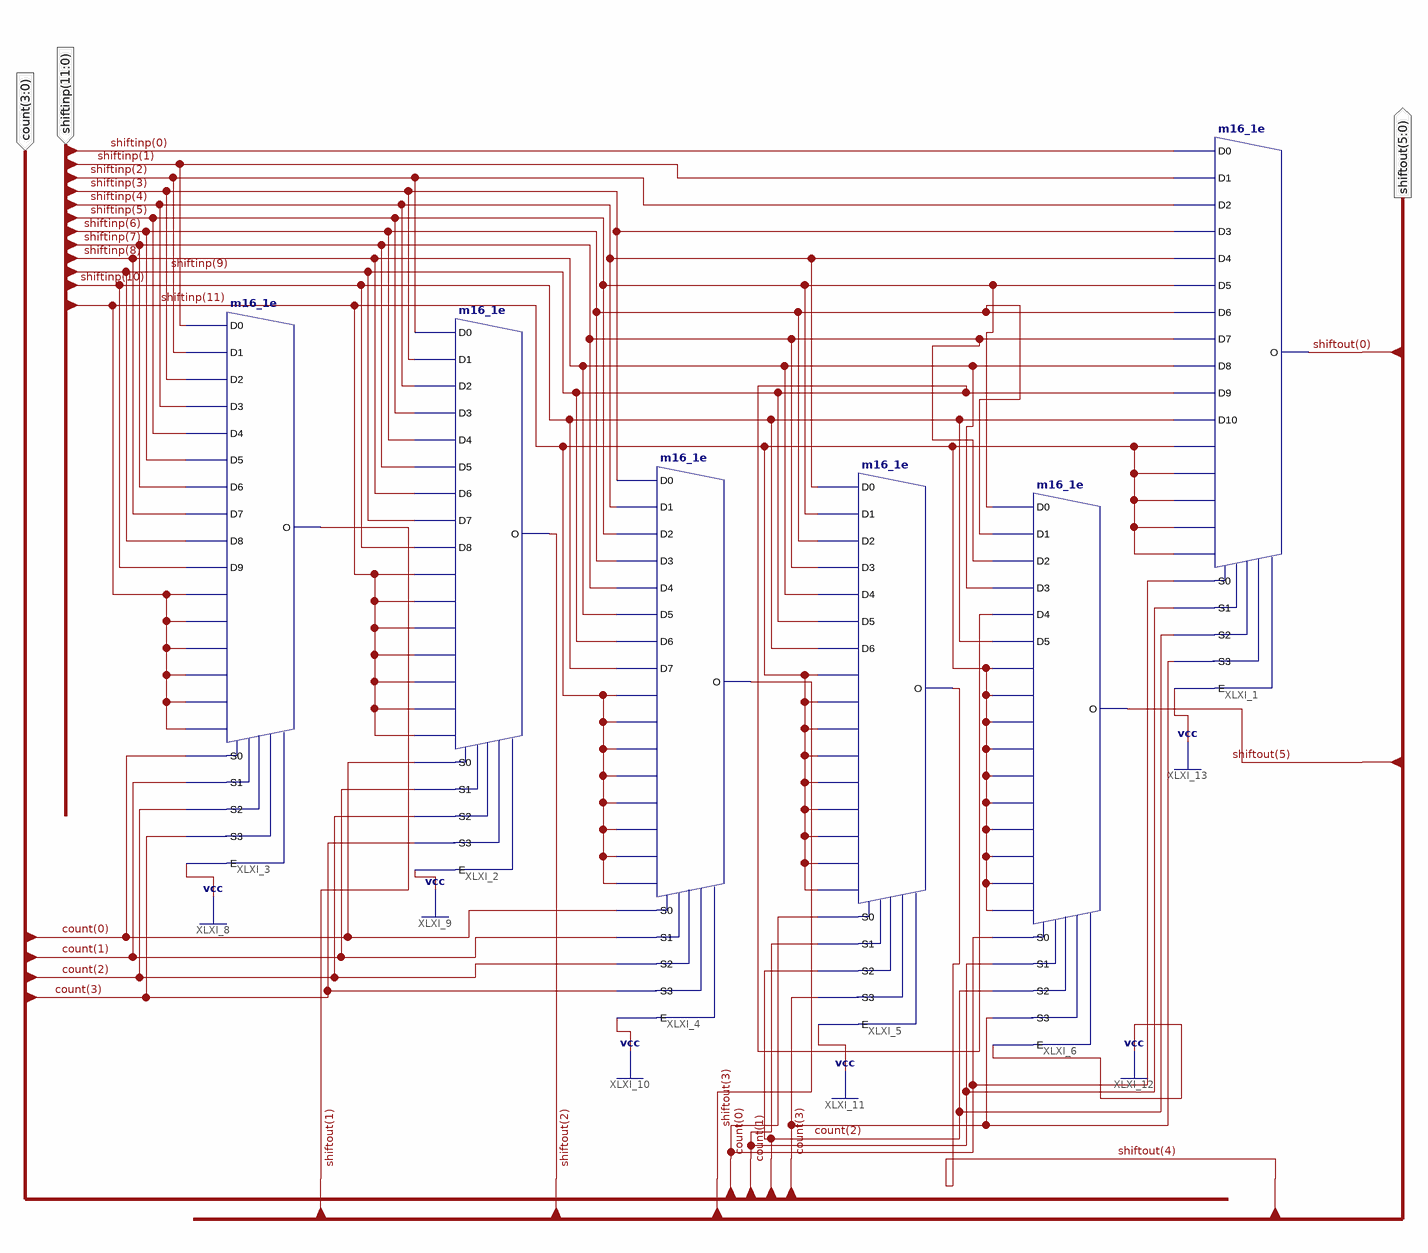
[diagram p0: schematic sheet 1]
// Xilinx ISE schematic shifter.sch (spartan3) as structural Verilog: 6 symbols, 3 ports
module shifter (
  input  [11:0] shiftinp,
  input  [3:0] count,
  output [5:0] shiftout
);

  m16_1e XLXI_1 (
    .D0(shiftinp[0]), .D1(shiftinp[1]), .D10(shiftinp[10]), .D11(shiftinp[11]), .D12(shiftinp[11]),
    .D13(shiftinp[11]), .D14(shiftinp[11]), .D15(shiftinp[11]), .D2(shiftinp[2]), .D3(shiftinp[3]),
    .D4(shiftinp[4]), .D5(shiftinp[5]), .D6(shiftinp[6]), .D7(shiftinp[7]), .D8(shiftinp[8]),
    .D9(shiftinp[9]), .E(1'b1), .S0(count[0]), .S1(count[1]), .S2(count[2]), .S3(count[3]), .O(shiftout[0]));
  m16_1e XLXI_2 (
    .D0(shiftinp[2]), .D1(shiftinp[3]), .D10(shiftinp[11]), .D11(shiftinp[11]), .D12(shiftinp[11]),
    .D13(shiftinp[11]), .D14(shiftinp[11]), .D15(shiftinp[11]), .D2(shiftinp[4]), .D3(shiftinp[5]),
    .D4(shiftinp[6]), .D5(shiftinp[7]), .D6(shiftinp[8]), .D7(shiftinp[9]), .D8(shiftinp[10]),
    .D9(shiftinp[11]), .E(1'b1), .S0(count[0]), .S1(count[1]), .S2(count[2]), .S3(count[3]), .O(shiftout[2]));
  m16_1e XLXI_3 (
    .D0(shiftinp[1]), .D1(shiftinp[2]), .D10(shiftinp[11]), .D11(shiftinp[11]), .D12(shiftinp[11]),
    .D13(shiftinp[11]), .D14(shiftinp[11]), .D15(shiftinp[11]), .D2(shiftinp[3]), .D3(shiftinp[4]),
    .D4(shiftinp[5]), .D5(shiftinp[6]), .D6(shiftinp[7]), .D7(shiftinp[8]), .D8(shiftinp[9]),
    .D9(shiftinp[10]), .E(1'b1), .S0(count[0]), .S1(count[1]), .S2(count[2]), .S3(count[3]), .O(shiftout[1]));
  m16_1e XLXI_4 (
    .D0(shiftinp[3]), .D1(shiftinp[4]), .D10(shiftinp[11]), .D11(shiftinp[11]), .D12(shiftinp[11]),
    .D13(shiftinp[11]), .D14(shiftinp[11]), .D15(shiftinp[11]), .D2(shiftinp[5]), .D3(shiftinp[6]),
    .D4(shiftinp[7]), .D5(shiftinp[8]), .D6(shiftinp[9]), .D7(shiftinp[10]), .D8(shiftinp[11]),
    .D9(shiftinp[11]), .E(1'b1), .S0(count[0]), .S1(count[1]), .S2(count[2]), .S3(count[3]), .O(shiftout[3]));
  m16_1e XLXI_5 (
    .D0(shiftinp[4]), .D1(shiftinp[5]), .D10(shiftinp[11]), .D11(shiftinp[11]), .D12(shiftinp[11]),
    .D13(shiftinp[11]), .D14(shiftinp[11]), .D15(shiftinp[11]), .D2(shiftinp[6]), .D3(shiftinp[7]),
    .D4(shiftinp[8]), .D5(shiftinp[9]), .D6(shiftinp[10]), .D7(shiftinp[11]), .D8(shiftinp[11]),
    .D9(shiftinp[11]), .E(1'b1), .S0(count[0]), .S1(count[1]), .S2(count[2]), .S3(count[3]), .O(shiftout[4]));
  m16_1e XLXI_6 (
    .D0(shiftinp[5]), .D1(shiftinp[6]), .D10(shiftinp[11]), .D11(shiftinp[11]), .D12(shiftinp[11]),
    .D13(shiftinp[11]), .D14(shiftinp[11]), .D15(shiftinp[11]), .D2(shiftinp[7]), .D3(shiftinp[8]),
    .D4(shiftinp[9]), .D5(shiftinp[10]), .D6(shiftinp[11]), .D7(shiftinp[11]), .D8(shiftinp[11]),
    .D9(shiftinp[11]), .E(1'b1), .S0(count[0]), .S1(count[1]), .S2(count[2]), .S3(count[3]), .O(shiftout[5]));
endmodule
